# Altium schematic sheet External SIM Tray.SchDoc: External SIM Tray
size A4
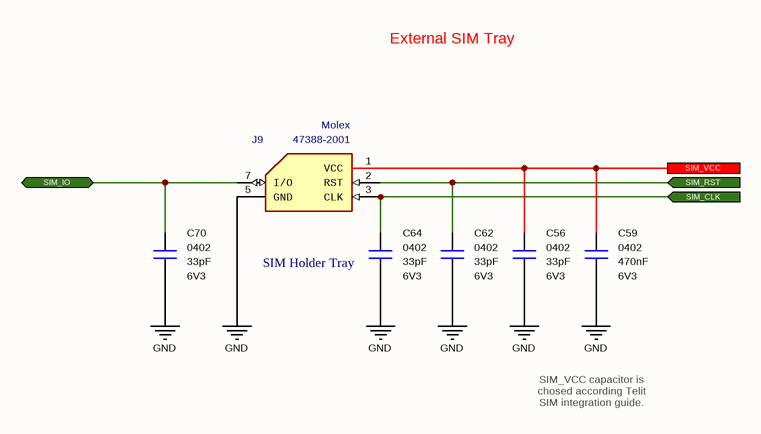
[diagram p0: External SIM Tray.SchDoc]

## Parts
C56  value 33pF  Case: 0402  Voltage: 6V3  [CAPACITOR_0402]  (hidden comment: Multilayer Ceramic Capacitor)
C59  value 470nF  Case: 0402  Voltage: 6V3  [CAPACITOR_0402]  (hidden comment: Multilayer Ceramic Capacitor)
C62  value 33pF  Case: 0402  Voltage: 6V3  [CAPACITOR_0402]  (hidden comment: Multilayer Ceramic Capacitor)
C64  value 33pF  Case: 0402  Voltage: 6V3  [CAPACITOR_0402]  (hidden comment: Multilayer Ceramic Capacitor)
C70  value 33pF  Case: 0402  Voltage: 6V3  [CAPACITOR_0402]  (hidden comment: Multilayer Ceramic Capacitor)
J9  SIM Holder Tray  Manufacturer_Name: Molex  Manufacturer_Part_Number: 47388-2001  [Connector - SIM Tray]

## Ports
SIM_CLK (in), SIM_IO (bidir), SIM_RST (in), SIM_VCC

## Nets
GND: C56.1 C59.1 C62.1 C64.1 C70.1 J9.5(GND)
SIM_CLK: C64.2 J9.3(CLK) ; port SIM_CLK
SIM_IO: C70.2 J9.7(I/O) ; port SIM_IO
SIM_RST: C62.2 J9.2(RST) ; port SIM_RST
SIM_VCC: C56.2 C59.2 J9.1(VCC) ; port SIM_VCC

## Notes on the sheet
- External SIM Tray
- SIM_VCC capacitor is chosed according Telit SIM integration guide.
- Title
- Size:
- Date:
- A4
- Number:
- Time:
- Revision:
- Sheet
- of
- File:

## Library data of the parts
C56 C62 C64 C70 = Capacitor - 33pF [0402-6V3]: Capacitor - 33pF [0402] (Ceramic); Manufacturer Name: Kemet; Manufacturer Part Number: C0402C330J9RACAUTO; Dielectric: X7R; Tolerance: 10%; Height: 0.5mm; Mouser Part Number: 80-C0402C330J9RAUTO; Maximum Operating Temperature: +125; Minimum Operating Temperature: -55; ROHS: Yes; ComponentLink1Description: DataSheet; ComponentLink1URL: https://api.kemet.com/component-edge/download/datasheet/C0402C330J9RACAUTO.pdf; ComponentLink2Description: Mouser; ComponentLink2URL: https://www.mouser.com/Search/Refine.aspx?Keyword=80-C0402C330J9RAUTO; Supplier 1: Mouser; Supplier Part Number 1: 80-C0402C330J9RAUTO
C59 = Capacitor - 470nF [0402-6V3]: Capacitor - 470nF [0402] (Ceramic); Manufacturer Name: AVX; Manufacturer Part Number: 04026C474KAT2A; Dielectric: X7R; Tolerance: %10; Height: 0.4mm; Mouser Part Number: 581-04026C474KAT2A; ComponentLink1Description: Mouser; ComponentLink1URL: https://www.mouser.com.tr/ProductDetail/AVX/04026D104KAT4A?qs=sGAEpiMZZMs0AnBnWHyRQPg4iYkCw7IMED%2F4kpqgf7w%3D; ComponentLink2Description: DataSheet; ComponentLink2URL: https://www.mouser.com.tr/datasheet/2/40/cx5r-776519.pdf; ROHS: Yes; Maximum Operating Temperature: +125; Minimum Operating Temperature: -55; Supplier 1: Mouser; Supplier Part Number 1: 581-04026C474KAT2A
J9 = Connector - Sim Holder: Memory Card Connectors ASSY 1.90 SIM CARD R IM CARD READER CONN.; Card Type: Mini SIM; Mouser_Part_Number: 538-47388-2001; Supplier 1: Arrow; Supplier 2: Mouser; Supplier 3: Farnell; Supplier Part Number 1: 47388-2001; Supplier Part Number 2: 538-47388-2001; Supplier Part Number 3: 2426322